# Altium schematic sheet Amplifier.SchDoc
size B; SheetNumber: 8; SheetTotal: 17
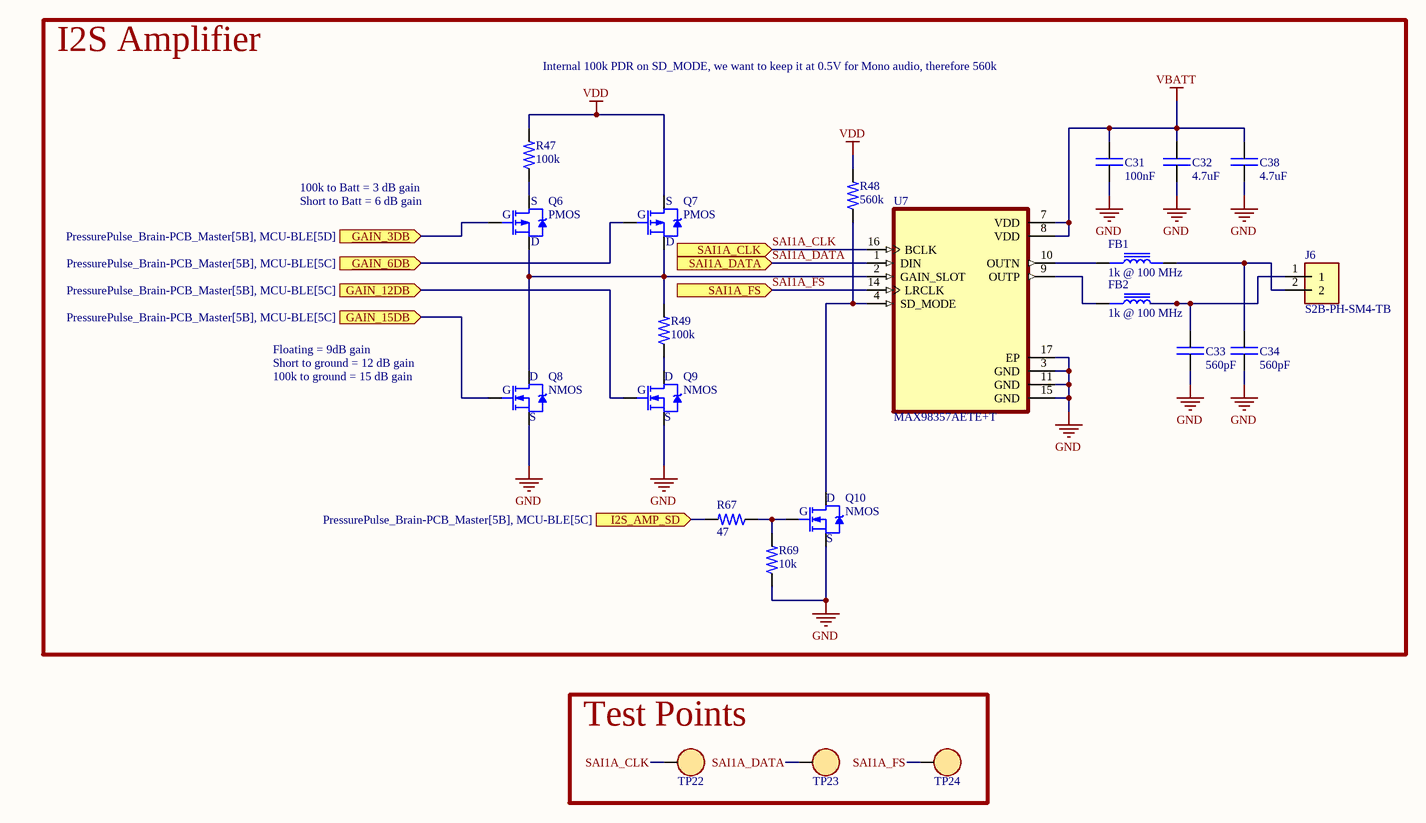
[diagram p0: Amplifier.SchDoc]

## Parts
C31  value 100nF  [0402C]  (hidden comment: CAP)
C32  value 4.7uF  [0402C]  (hidden comment: CAP)
C33  value 560pF  [0402C]  (hidden comment: CAP)
C34  value 560pF  [0402C]  (hidden comment: CAP)
C38  value 4.7uF  [0402C]  (hidden comment: CAP)
FB1  1k @ 100 MHz  [0603L]
FB2  1k @ 100 MHz  [0603L]
J6  S2B-PH-SM4-TB  [JST_PH-2POS-SMT-RA]
Q6  PMOS  [SOT-23]
Q7  PMOS  [SOT-23]
Q8  NMOS  [SOT-23]
Q9  NMOS  [SOT-23]
Q10  NMOS  [SOT-23]
R47  value 100k  [0402R]  (hidden comment: RES)
R48  value 560k  [0402R]  (hidden comment: RES)
R49  value 100k  [0402R]  (hidden comment: RES)
R67  value 47  [0402R]  (hidden comment: RES)
R69  value 10k  [0402R]  (hidden comment: RES)
TP22  RH-5019  [TP - RH-5019]  (value not drawn)
TP23  RH-5019  [TP - RH-5019]  (value not drawn)
TP24  RH-5019  [TP - RH-5019]  (value not drawn)
U7  MAX98357AETE+T  [16-WFQFN EXPOSED PAD]

## Blocks framed on the sheet
I2S Amplifier: C31-C34 C38 FB1 FB2 J6 Q6-Q10 R47-R49 R67 R69 U7
Test Points: TP22-TP24

## Ports
GAIN_3DB (in, see PressurePulse_Brain-PCB_Master[5B], MCU-BLE[5D]), GAIN_6DB (in, see PressurePulse_Brain-PCB_Master[5B], MCU-BLE[5C]), GAIN_12DB (in, see PressurePulse_Brain-PCB_Master[5B], MCU-BLE[5C]), GAIN_15DB (in, see PressurePulse_Brain-PCB_Master[5B], MCU-BLE[5C]), I2S_AMP_SD (in, see PressurePulse_Brain-PCB_Master[5B], MCU-BLE[5C]), SAI1A_CLK (in, see PressurePulse_Brain-PCB_Master[5B], MCU-BLE[5C]), SAI1A_DATA (in, see PressurePulse_Brain-PCB_Master[5B], MCU-BLE[5C]), SAI1A_FS (in, see PressurePulse_Brain-PCB_Master[5B], MCU-BLE[5C])

## Nets
GND: C31.2 C32.1 C33.1 C34.1 C38.1 Q8.S Q9.S Q10.S R69.1 U7.3(GND) U7.11(GND) U7.15(GND) U7.17(EP)
VBATT: C31.1 C32.2 C38.2 U7.7(VDD) U7.8(VDD)
VDD: Q7.S R47.2 R48.2
GAIN_3DB: Q6.G ; port GAIN_3DB
GAIN_6DB: Q7.G ; port GAIN_6DB
GAIN_12DB: Q9.G ; port GAIN_12DB
GAIN_15DB: Q8.G ; port GAIN_15DB
I2S_AMP_SD: R67.2 ; port I2S_AMP_SD
SAI1A_CLK: TP22.1 U7.16(BCLK) ; port SAI1A_CLK
SAI1A_DATA: TP23.1 U7.1(DIN) ; port SAI1A_DATA
SAI1A_FS: TP24.1 U7.14(LRCLK) ; port SAI1A_FS
NetC33_2: C33.2 FB2.2 J6.1
NetC34_2: C34.2 FB1.2 J6.2
NetFB1_1: FB1.1 U7.10(OUTN)
NetFB2_1: FB2.1 U7.9(OUTP)
NetQ6_D: Q6.D Q7.D Q8.D R49.2 U7.2(GAIN_SLOT)
NetQ6_S: Q6.S R47.1
NetQ9_D: Q9.D R49.1
NetQ10_D: Q10.D R48.1 U7.4(SD_MODE)
NetQ10_G: Q10.G R67.1 R69.2

## Notes on the sheet
- Internal 100k PDR on SD_MODE, we want to keep it at 0.5V for Mono audio, therefore 560k
- 100k to Batt = 3 dB gain
- (near Q6) Short to Batt = 6 dB gain
- Floating = 9dB gain
- 100k to ground = 15 dB gain
- Short to ground = 12 dB gain

## Library data of the parts
C31-C34 C38 = CAP: Capacitor; MFR: *; MFR PN: *; JLCPCB PN: *; Footprint: *
FB1 FB2 = FERRITE BEAD: MFR: TDK; MFR PN: MMZ1608Y102BTD25; Value: MMZ1608Y102BTD25; JLCPCB PN: C531293; Footprint: *
J6 = JST CONN 2POS PH: Connector Header Surface Mount, Right Angle 2 position 0.079 (2.00mm); MFR PN: S2B-PH-SM4-TB(LF)(SN); MFR: JST Sales; Type: SMD; Value: S2B-PH-SM4-TB; JLCPCB PN: C295747
Q6 Q7 = PMOS: P-Channel MOSFET; MFR: Diodes Incorporated; Value: PPMT12V4; Footprint: *; JLCPCB PN: C110724
Q8-Q10 = NMOS: 100V 1.6A 1.3W 220mΩ@10V,1.6A N Channel SOT-23  MOSFETs ROHS; MFR: Infineon; Value: IRLML0100TRPBF; MFR PN: IRLML0100TRPBF; JLCPCB PN: C53658
R47-R49 R67 R69 = RES: Resistor; MFR PN: *; MFR: *
  R47 R49: JLCPCB PN: C140218
  R48 R67: JLCPCB PN: *
  R69: JLCPCB PN: C843837
TP22-TP24 = TEST POINT: MFR: ronghe; MFR PN: RH-5019; Value: RH-5019; JLCPCB PN: C5199800
U7 = MAX98357AETE+T: I2S Audio DAC and amp; MFR: Analog Devices; Value: MAX98357AETE+T; Type: SMD; Footprint: *; JLCPCB PN: C910544